# EAGLE board EEZ CF-DIC r4B4 (EAGLE 7.2.0)
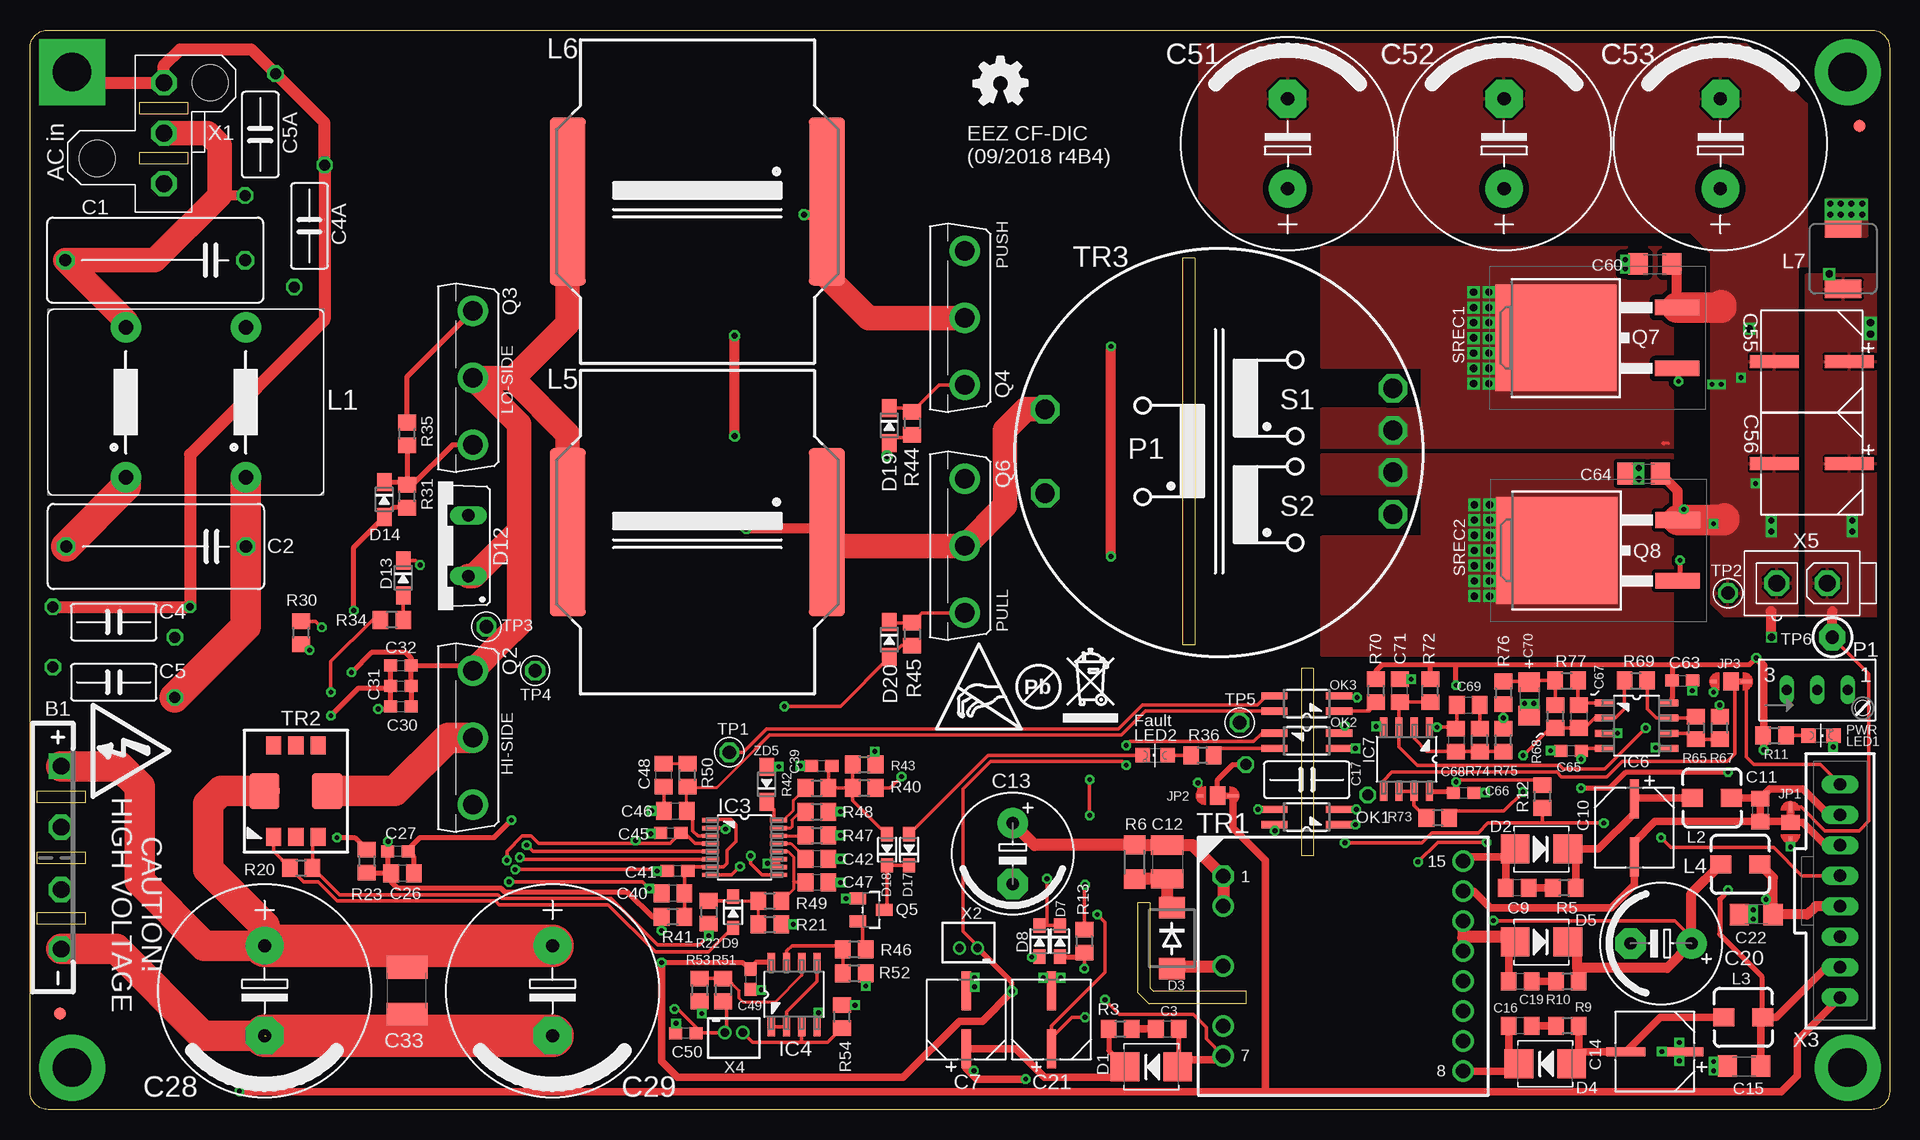
[diagram p3: board, top side]
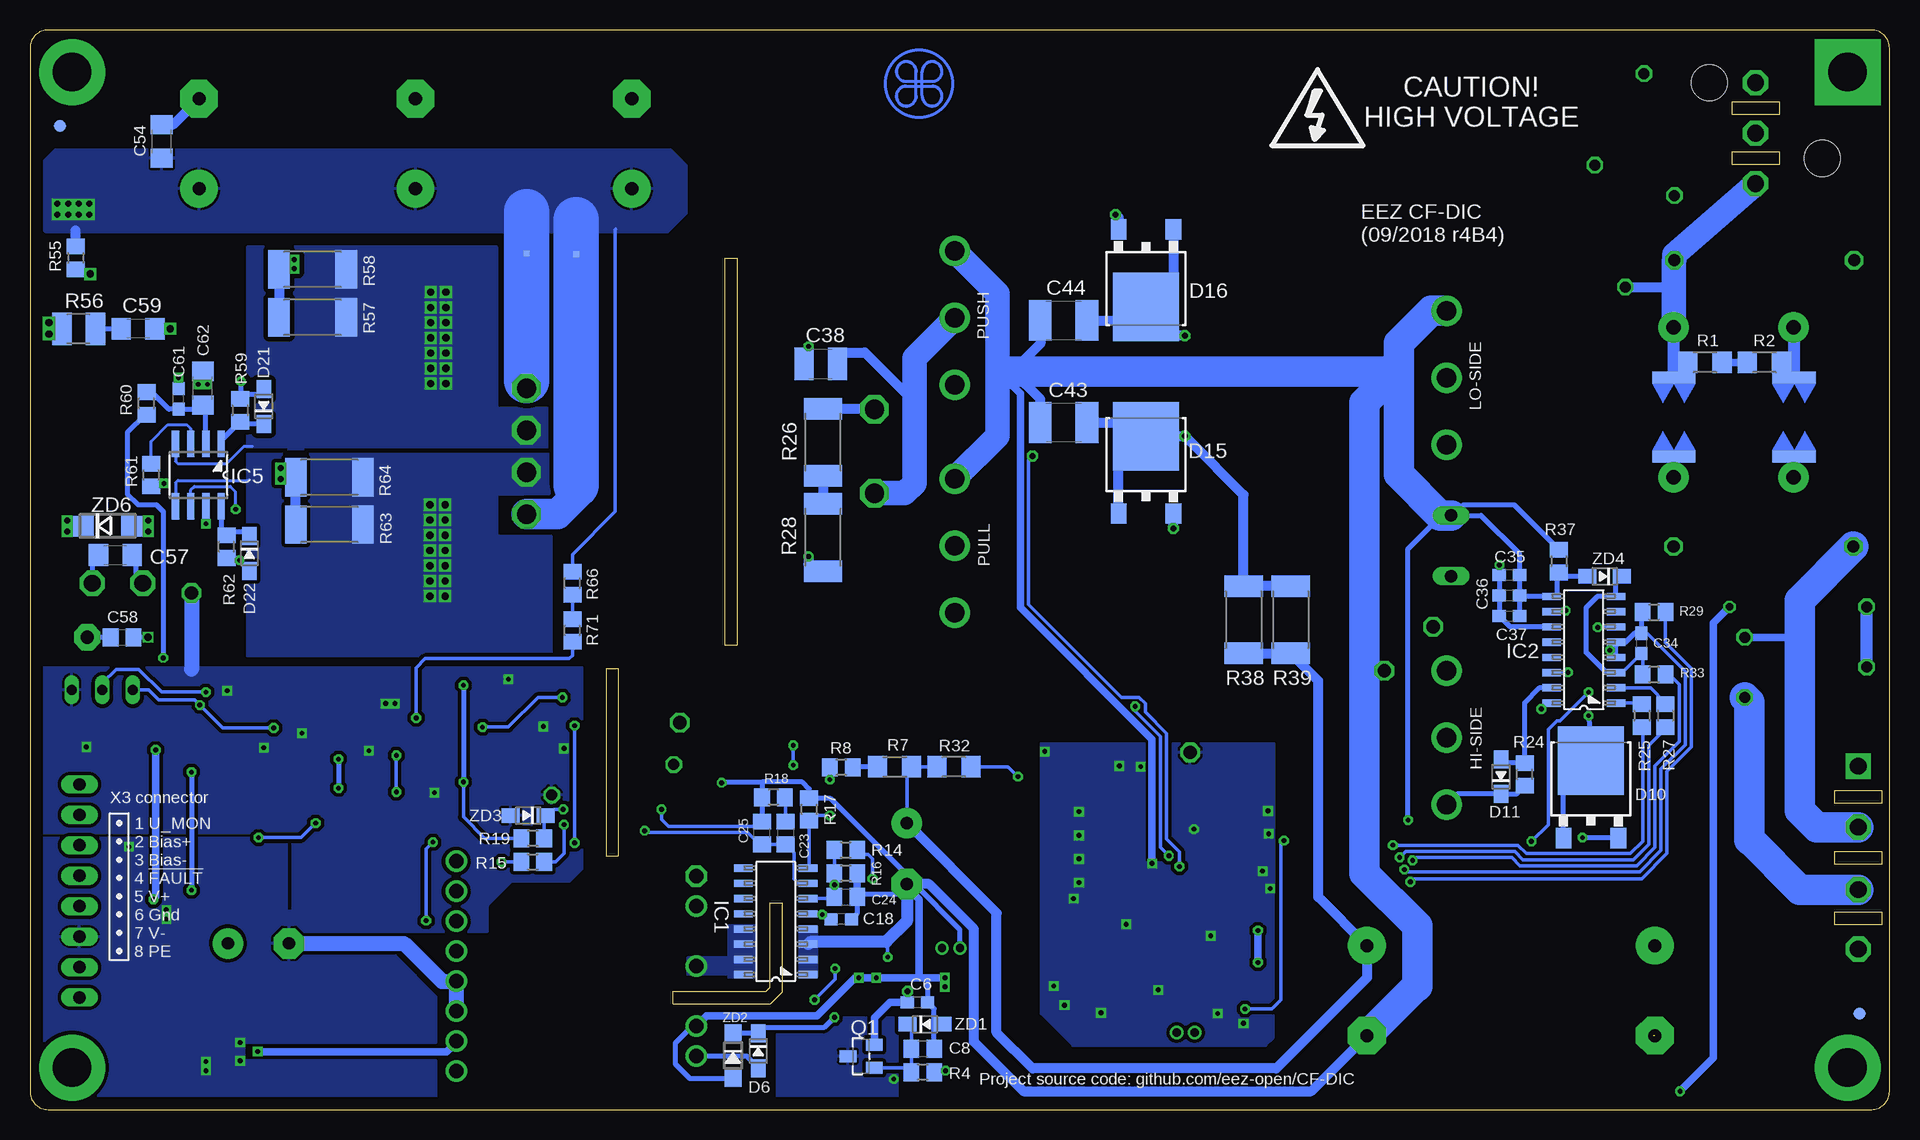
[diagram p4: board, bottom side, seen from below]

Size 155 x 90 mm. Coordinates in mm from the lower left corner, seen from the top.
Outline: 155,53.59 155,88.5 arc90 153.5,90 1.5,90 arc90 0,88.5 0,1.5 arc90 1.5,0 153.5,0 arc90 155,1.5 155,53.58
Outline: 96.08,70.99 96.08,38.73 97.09,38.73 97.09,70.99 96.08,70.99
Outline: 92.33,17.24 92.33,9.78 93.28,8.83 101.38,8.83 101.38,9.84 93.66,9.84 93.34,10.16 93.34,17.24 92.33,17.24
Outline: 105.98,36.77 105.98,21.14 107,21.14 107,36.77 105.98,36.77
Copper layers (1*16): Top 0.035mm / dielectric 1.5mm / Bottom 0.035mm
Design rules "default": minimum track width 6mil, minimum drill 0.3mm, track to track 6mil, track to pad 6mil, pad to pad 6mil, via to via 6mil, smd to smd 6mil, copper to edge 40mil, drill to drill 8mil, minimum pad ring 4mil, minimum via ring 8mil, stop-mask expansion 2.5mil, vias tented up to drill 0.55mm, thermal gap 8mil
Net classes: 0 default: width 0.203 mm, drill 0.3 mm, clearance 0.203 mm; 1 lvds: width 0.152 mm, drill 0.3 mm, clearance 0.152 mm to class 0, clearance 0.152 mm; 2 gnd: width 0.254 mm, drill 0.584 mm, clearance 0.254 mm

## Footprints (pad centres in the part's own frame; a part is rotated, then mirrored left to right if it is on the bottom)
GBU4K_CRE = drill 1.4 square: + -7.62,0 | drill 1.4 octagon: - 7.62,0; AC1 -2.54,0; AC2 2.667,0
C150-072X183 = drill 1.016 octagon: 1 -7.493,0; 2 7.493,0
C0805 = smd 1.3 x 1.5: 1 -0.95,0; 2 0.95,0
CY075-032X103 = drill 0.914 octagon: 1 -5.08,1.27; 2 5.08,-1.27
C0603 = smd 1.1 x 1: 1 -0.85,0; 2 0.85,0
CAPAE660X610N = smd 3.251 x 0.762: 1 -2.413,0; 2 2.413,0
C1210 = smd 1.6 x 2.7: 1 -1.4,0; 2 1.4,0
ECAP5/10.5 = drill 1.016 pad 2.54: + -2.54,0 | drill 1.016 pad 2.54 octagon: - 2.54,0
C1206 = smd 1.6 x 1.8: 1 -1.4,0; 2 1.4,0
ECAP7.5/18 = drill 1.1 pad 3.14: + -3.75,0 | drill 1.1 pad 3.14 octagon: - 3.75,0
C1812 = smd 1.9 x 3.4: 1 -1.95,0; 2 1.95,0
CAPAE830X1050N = smd 4.064 x 1.092: 1 -3.124,0; 2 3.124,0
EC1206 = smd 1.6 x 1.8: + -1.4,0; - 1.4,0
SMB = smd 2.4 x 2.4: A 2.2,0; C -2.2,0
DO214AA = smd 1.8 x 2.2: A 2.55,0; C -2.55,0
SOD323-W = smd 1.5 x 1.2: A 1.45,0; C -1.45,0
SOD323-R = smd 1.2 x 1: A 1.3,0; C -1.3,0
TO252 = smd 1.3 x 1.7: 1 -2.285,-5.49; 2 2.285,-5.49 | smd 5.5 x 5.7: 3 0,0.95
TO220-2 = drill 1.016 long: 1 -2.54,-2.54; 2 2.54,-2.54
FIDUCIAL_DUAL = smd 1.016 x 1.016 bottom: B 0,0 | smd 1.016 x 1.016: T 0,0
SOIC-16 = smd 1.549 x 0.61: 1 -2.692,4.445; 2 -2.692,3.175; 3 -2.692,1.905; 4 -2.692,0.635; 5 -2.692,-0.635; 6 -2.692,-1.905; 7 -2.692,-3.175; 8 -2.692,-4.445; 9 2.692,-4.445; 10 2.692,-3.175; 11 2.692,-1.905; 12 2.692,-0.635; 13 2.692,0.635; 14 2.692,1.905; 15 2.692,3.175; 16 2.692,4.445
MTC16 = smd 1.422 x 0.356: 1 -2.845,2.275; 2 -2.845,1.625; 3 -2.845,0.975; 4 -2.845,0.325; 5 -2.845,-0.325; 6 -2.845,-0.975; 7 -2.845,-1.625; 8 -2.845,-2.275; 9 2.845,-2.275; 10 2.845,-1.625; 11 2.845,-0.975; 12 2.845,-0.325; 13 2.845,0.325; 14 2.845,0.975; 15 2.845,1.625; 16 2.845,2.275
SOIC127P600X173-8N = smd 1.55 x 0.6: 1 -2.7,1.9; 2 -2.7,0.63; 3 -2.7,-0.64; 4 -2.7,-1.91; 5 2.7,-1.91; 6 2.7,-0.64; 7 2.7,0.63; 8 2.7,1.9
SO8 = smd 0.6 x 2.2: 1 -1.905,-2.6; 2 -0.635,-2.6; 3 0.635,-2.6; 4 1.905,-2.6; 5 1.905,2.6; 6 0.635,2.6; 7 -0.635,2.6; 8 -1.905,2.6
JP3-CUT = smd 1.27 x 1.524: COM 0,0 | smd 0.889 x 0.254: NC -1.27,0 | smd 0.508 x 0.254: NO 1.46,0
RN214 = drill 1.2 pad 2.54: 1 -6.25,-5; 2 6.25,-5; 3 -6.25,5; 4 6.25,5
DE0403 = smd 1.5 x 1.75: 1 0,1.626; 2 0,-1.625
MURATA_6000B = smd 3 x 14: 1 -10.8,0; 2 10.8,0
IHLP-2020BZ-11 = smd 3.048 x 1.524: 1 0,2.515; 2 0,-2.515
LED_0805 = smd 1.2 x 1.2: A 0,-1.05; C 0,1.05
SO4 = smd 0.6 x 2.2: 1 -0.635,-2.7; 2 0.635,-2.7; 3 0.635,2.7; 4 -0.635,2.7
S64W = drill 0.813 long: A 2.54,1.27; E -2.54,1.27; S 0,1.27
SOT23-BEC = smd 1 x 1.4: B -0.95,-1.1; C 0,1.1; E 0.95,-1.1
TO247BV-ROUND = drill 1.6 pad 2.54: D 0,-2.921; G -5.588,-2.921; S 5.588,-2.921
SOT23 = smd 1 x 1.4: 1 -0.95,-1.1; 2 0.95,-1.1; 3 0,1.1
TO263 = smd 1.3 x 3.7: 1 -2.54,-7.87; 2 2.54,-7.87 | smd 8.9 x 10.1: 3 0,2.23
R1206 = smd 1.6 x 1.803: 1 -1.422,0; 2 1.422,0
R0805 = smd 1.3 x 1.5: 1 -0.95,0; 2 0.95,0
R2512 = smd 1.8 x 3.2: 1 -2.8,0; 2 2.8,0
R1210 = smd 1.6 x 2.7: 1 -1.4,0; 2 1.4,0
PCB-SAR_2.4MM = smd 3.6 x 1: 1 0,-3.3; 2 0,3.3
SHORT_NOHOLE = smd 0.5 x 0.25 bottom: P$1 0,0.117; P$2 0,-0.117
PCB_SHIELD_TAB = drill 1.1 octagon: 1 0,0
TP_1.1MM_2 = drill 0.6 square: GND 5.08,0 | drill 1.1 pad 2.184 octagon: TIP 0,0
FERYSTER_5572 = drill 1.2 octagon: 1 -10,7.5 | drill 1.2: 2 -10,5; 4 -10,0; 6 -10,-5; 7 -10,-7.5; 8 10,-8.75; 9 10,-6.25; 10 10,-3.75; 11 10,-1.25; 12 10,1.25; 13 10,3.75; 14 10,6.25; 15 10,8.75
MURATA_5300 = smd 1.27 x 1.524: 1 -1.854,-3.81; 2 0,-3.81; 3 1.854,-3.81; 4 1.854,3.81; 5 0,3.81; 6 -1.854,3.81 | smd 2.54 x 3.048: 7 2.616,0; 8 -2.616,0
VAC_DUAL_SEC = drill 1.6 octagon: P1 -14.5,3.5; P1_DOT -14.5,-3.5; S1 14.5,5.25; S1_DOT 14.5,1.75; S2 14.5,-1.75; S2_DOT 14.5,-5.25
MINIFIT_39301039_CRE = drill 1.4 octagon: 1 0,4.2; 2 0,0; 3 0,-4.2 | hole 3: 5.55,2.1; -3.85,-4.2
B2B-ZR = drill 0.7 pad 1.1: 1 -0.75,0; 2 0.75,0
70543-08 = drill 1.016 long: 1 -8.89,0; 2 -6.35,0; 3 -3.81,0; 4 -1.27,0; 5 1.27,0; 6 3.81,0; 7 6.35,0; 8 8.89,0
MINIFIT_5566-02A = drill 1.4 octagon: 1 0,2.1; 2 0,-2.1
SOD123 = smd 1.4 x 1.4: A 1.9,0; C -1.9,0
DO214AC = smd 1.8 x 1.7: A 2.05,0; C -2.05,0

## Placement (x,y rotation side)
B1  GBU4K  [GBU4K_CRE]  2.6,21 270 top
C1  MKP-X2-220NR15/310  [C150-072X183]  10.44,70.8 180 top
C2  MKP-X2-220NR15/310  [C150-072X183]  10.5,46.94 180 top
C3  3n3  [C0805]  94.81,6.73 0 top
C4  CY1Y-470P  [CY075-032X103]  6.99,40.64 0 top
C4A  N.C.  [CY075-032X103]  23.29,73.66 270 top
C5  CY1Y-470P  [CY075-032X103]  6.99,35.62 0 top
C5A  N.C.  [CY075-032X103]  19.19,81.28 270 top
C6  N.C.  [C0603]  81.03,8.95 0 bottom
C7  EEEFK1V470P  [CAPAE660X610N]  78.04,7.49 90 top
C8  470n  [C0805]  80.58,5.08 0 bottom
C9  3n3  [C0805]  123.95,18.48 180 top
C10  EEEFK1V470P  [CAPAE660X610N]  133.73,23.5 270 top
C11  1u  [C0805]  144.21,24.96 270 top
C12  1n/1kV  [C1210]  94.81,20.64 270 top
C13  UCY2G6R8MPD  [ECAP5/10.5]  81.92,21.34 270 top
C14  EEEFK1V470P  [CAPAE660X610N]  135.45,4.83 180 top
C15  4u7  [C1206]  142.88,3.62 0 top
C16  3n3  [C0805]  124.21,6.99 180 top
C17  CY1Y-470P  [CY075-032X103]  106.43,27.5 0 top
C18  100n  [C0603]  87.38,15.88 180 bottom
C19  3n3  [C0805]  124.21,10.67 180 top
C20  470u  [ECAP5/10.5]  135.95,13.84 180 top
C21  EEEFK1V470P  [CAPAE660X610N]  85.15,7.49 90 top
C22  4u7  [C1206]  143.89,16.26 180 top
C23  33n  [C0805]  92.01,23.05 270 bottom
C24  100p  [C0805]  87,17.72 0 bottom
C25  2n2  [C0805]  93.98,23.05 90 bottom
C26  1u  [C0805]  31.05,19.68 180 top
C27  100n  [C0603]  30.67,21.53 180 top
C28  UCY2G121MHD  [ECAP7.5/18]  19.56,9.91 270 top
C29  UCY2G121MHD  [ECAP7.5/18]  43.56,9.91 270 top
C30  10n  [C0603]  30.92,33.59 0 top
C31  100n  [C0603]  30.92,35.31 0 top
C32  100n  [C0603]  30.92,37.02 0 top
C33  100n/500V  [C1812]  31.43,9.91 90 top
C34  100n  [C0603]  20.7,38.86 270 bottom
C35  10n  [C0603]  31.69,44.58 0 bottom
C36  100n  [C0603]  31.69,42.86 0 bottom
C37  100n  [C0603]  31.69,41.15 0 bottom
C38  2n2/1kV  [C1210]  89.09,62.17 0 bottom
C39  10n  [C0603]  65.98,28.64 180 top
C40  1u  [C0805]  53.59,18.03 180 top
C41  100n  [C0603]  53.98,19.88 180 top
C42  1u  [C0805]  65.6,20.89 180 top
C43  100n/500V  [C1812]  68.83,57.28 0 bottom
C44  100n/500V  [C1812]  68.83,65.79 0 bottom
C45  100n  [C0603]  53.4,23.05 0 top
C46  470p  [C0805]  53.78,24.89 0 top
C47  220p  [C0805]  65.6,18.92 180 top
C48  N.C.  [C0805]  52.83,27.88 90 top
C49  100n  [C0603]  60.07,10.86 270 top
C50  N.C.  [C0603]  54.67,6.35 180 top
C51  UPW1J152MHD  [ECAP7.5/18]  104.84,80.52 90 top
C52  UPW1J152MHD  [ECAP7.5/18]  122.87,80.52 90 top
C53  UPW1J152MHD  [ECAP7.5/18]  140.91,80.52 90 top
C54  1u/100V  [C1206]  144.02,80.71 90 bottom
C55  HHXC630ARA330MHA0G  [CAPAE830X1050N]  148.53,62.36 180 top
C56  HHXC630ARA330MHA0G  [CAPAE830X1050N]  148.53,53.85 180 top
C57  1u/100V  [C1206]  147.89,46.23 0 bottom
C58  100n/100V  [C0805]  147.32,39.37 0 bottom
C59  N.C.  [C1206]  145.99,65.09 180 bottom
C60  4n7/200V  [C1206]  135.45,70.48 0 top
C61  100n  [C0603]  142.62,59.25 90 bottom
C62  4u7  [C1206]  140.59,60.13 90 bottom
C63  100n  [C0603]  137.73,35.75 0 top
C64  4n7/200V  [C1206]  134.49,53.02 0 top
C65  100n  [C0603]  128.46,29.91 180 top
C66  100n  [C0603]  119.51,26.42 0 top
C67  100p  [C0805]  129.1,32.77 270 top
C68  100p  [C0805]  118.87,30.8 270 top
C69  33n  [C0805]  119.89,33.72 0 top
C70  4u7  [EC1206]  124.97,34.23 270 top
C71  1u  [C0805]  114.17,34.92 90 top
D1  SS110B  [SMB]  93.47,3.56 0 top
D2  SS110B  [SMB]  125.98,21.72 180 top
D3  US1K-DIO  [DO214AA]  95.19,14.29 270 top
D4  SS110B  [SMB]  126.3,3.81 0 top
D5  SS110B  [SMB]  125.98,13.97 180 top
D6  1N5819HW-7-F  [SOD323-W]  94.3,4.89 270 bottom
D7  BAS316  [SOD323-R]  85.85,14.03 270 top
D8  BAS316  [SOD323-R]  84.14,14.03 270 top
D9  BAS316  [SOD323-R]  58.61,16.45 270 top
D10  C3D02065E  [TO252]  24.89,28.13 0 bottom
D11  N.C.  [SOD323-W]  32.38,27.75 90 bottom
D12  C3D03060A  [TO220-2]  34,47 90 top
D13  1N5819HW-7-F  [SOD323-W]  31.11,44.32 270 top
D14  N.C.  [SOD323-W]  29.53,50.86 270 top
D15  C3D02065E  [TO252]  61.98,55.18 0 bottom
D16  C3D02065E  [TO252]  61.98,67.88 180 bottom
D17  BAS316  [SOD323-R]  73.28,21.65 90 top
D18  BAS316  [SOD323-R]  71.44,21.65 90 top
D19  1N5819HW-7-F  [SOD323-W]  71.63,57.02 270 top
D20  1N5819HW-7-F  [SOD323-W]  71.63,39.18 270 top
D21  1N5819HW-7-F  [SOD323-W]  135.51,58.61 90 bottom
D22  1N5819HW-7-F  [SOD323-W]  136.72,46.35 270 bottom
EEZ_SIGNATURE  SIGNATURESMALL  [SIGNATURE_5MM]  80.88,85.51 180 top
FM1  FIDUCIAL_2  [FIDUCIAL_DUAL]  152.5,82 0 top
FM2  FIDUCIAL_2  [FIDUCIAL_DUAL]  2.5,8 0 top
IC1  VIPer35L  [SOIC-16]  92.84,15.68 180 bottom
IC2  SI8233BB-D-IS1  [SOIC-16]  25.49,38.33 180 bottom
IC3  LM5041B  [MTC16]  59.56,21.84 0 top
IC4  LM258D  [SOIC127P600X173-8N]  63.69,9.59 90 top
IC5  IR11688STRPBF  [SO8]  140.97,52.9 180 bottom
IC6  TL072  [SOIC127P600X173-8N]  133.92,32 0 top
IC7  TL103W  [SOIC127P600X173-8N]  114.74,29.21 270 top
JP1  JP3-CUT  [JP3-CUT]  146.75,23.94 270 top
JP2  JP3-CUT  [JP3-CUT]  99,26.16 180 top
JP3  JP3-CUT  [JP3-CUT]  141.8,35.69 180 top
L1  RN214-2.5-02-3M3  [RN214]  12.99,58.96 90 top
L2  DLG-0403-180  [DE0403]  140.21,25.97 90 top
L3  DLG-0403-180  [DE0403]  142.81,7.68 90 top
L4  DLG-0403-180  [DE0403]  142.56,20.45 90 top
L5  60B684C  [MURATA_6000B]  55.63,48.13 180 top
L6  60B684C  [MURATA_6000B]  55.63,75.69 180 top
L7  IHLP2020CZER3R3M11  [IHLP-2020BZ-11]  151.13,70.93 0 top
LED1  LTST-C170YKT  [LED_0805]  149.29,31.18 270 top
LED2  LTST-C170KRKT  [LED_0805]  93.79,29.53 90 top
OK1  TLP291-GB.SE-T  [SO4]  106.43,24.38 90 top
OK2  TLP291-GB.SE-T  [SO4]  106.43,30.73 270 top
OK3  TLP291-GB.SE-T  [SO4]  106.43,33.85 90 top
P1  T910W-50K  [S64W]  148.97,33.72 0 top
Q1  MMBT5551  [SOT23-BEC]  85.72,4.45 90 bottom
Q2  C3M0280090D  [TO247BV-ROUND]  34,31 90 top
Q3  C3M0280090D  [TO247BV-ROUND]  34,61 90 top
Q4  C3M0280090D  [TO247BV-ROUND]  75,66 90 top
Q5  NYC0102BLT1G  [SOT23]  70.1,16.64 270 top
Q6  C3M0280090D  [TO247BV-ROUND]  75,47 90 top
Q7  IRFS4321PBF  [TO263]  129.41,64.33 90 top
Q8  IRFS4321PBF  [TO263]  129.48,46.61 90 top
R1  220K  [R1206]  15.38,62.29 0 bottom
R2  220K  [R1206]  10.43,62.29 0 bottom
R3  120R  [R0805]  90.87,6.73 0 top
R4  1K8  [R0805]  80.58,3.11 180 bottom
R5  120R  [R0805]  127.89,18.48 180 top
R6  220K  [R1206]  92.08,20.64 270 top
R7  220K  [R1206]  82.93,28.57 180 bottom
R8  100K  [R0805]  87.38,28.51 180 bottom
R9  120R  [R0805]  128.14,6.99 180 top
R10  120R  [R0805]  128.14,10.67 180 top
R11  470R  [R0805]  145.41,31.18 0 top
R12  10K  [R0805]  126.05,26.1 270 top
R13  N.C.  [R0805]  87.88,14.03 270 top
R14  47K  [R0805]  87,21.65 0 bottom
R15  750R  [R0805]  113.09,20.64 0 bottom
R16  12K  [R0805]  87,19.68 180 bottom
R17  1K8  [R0805]  90.04,25.02 90 bottom
R18  47K  [R0805]  93.03,26.04 180 bottom
R19  1K  [R0805]  113.09,22.61 180 bottom
R20  10K  [R0805]  22.61,20.15 0 top
R21  6R2  [R0805]  61.66,15.43 0 top
R22  N.C.  [R0805]  56.58,16.45 270 top
R23  10R  [R0805]  28.07,20.7 270 top
R24  10R  [R0805]  30.42,27.94 90 bottom
R25  100R  [R0805]  20.64,32.83 270 bottom
R26  22R/2-3W  [R2512]  88.9,55.63 90 bottom
R27  100R  [R0805]  18.67,32.83 270 bottom
R28  22R/2-3W  [R2512]  88.9,47.69 90 bottom
R29  1R  [R0805]  19.62,41.47 0 bottom
R30  30K  [R0805]  22.61,39.75 90 top
R31  10R  [R0805]  31.43,51.12 90 top
R32  220K  [R1206]  77.98,28.57 0 bottom
R33  10R  [R0805]  19.62,36.26 180 bottom
R34  10R  [R0805]  30.16,40.83 180 top
R35  47K  [R0805]  31.43,56.32 90 top
R36  1K  [R0805]  97.73,29.53 180 top
R37  1R  [R0805]  27.56,45.72 270 bottom
R38  22R/2-3W  [R2512]  53.85,40.83 270 bottom
R39  22R/2-3W  [R2512]  49.91,40.83 270 bottom
R40  100K  [R0805]  69.53,26.8 180 top
R41  10R  [R0805]  53.59,16.07 180 top
R42  1K  [R0805]  65.6,26.8 0 top
R43  6K8  [R0805]  69.53,28.77 0 top
R44  22R  [R0805]  73.53,57.21 270 top
R45  22R  [R0805]  73.53,39.62 270 top
R46  1K  [R0805]  68.71,13.34 180 top
R47  30K  [R0805]  65.6,22.86 0 top
R48  82K  [R0805]  65.6,24.83 0 top
R49  1K  [R0805]  61.66,17.4 0 top
R50  N.C.  [R0805]  54.8,27.88 90 top
R51  4K7  [R0805]  57.78,9.97 270 top
R52  1K  [R0805]  68.71,11.37 0 top
R53  30K  [R0805]  55.82,9.97 270 top
R54  10K  [R0805]  67.69,7.75 90 top
R55  100R  [R0805]  151.19,70.99 270 bottom
R56  N.C.  [R1210]  150.94,65.09 180 bottom
R57  22R/2-3W  [R2512]  131.44,66.04 180 bottom
R58  22R/2-3W  [R2512]  131.44,70.04 180 bottom
R59  3R3  [R0805]  137.48,58.29 270 bottom
R60  10R  [R0805]  145.29,58.86 90 bottom
R61  47K  [R0805]  144.91,52.9 270 bottom
R62  3R3  [R0805]  138.62,46.93 90 bottom
R63  22R/2-3W  [R2512]  130.05,48.77 180 bottom
R64  22R/2-3W  [R2512]  130.05,52.7 180 bottom
R65  10K  [R0805]  138.87,31.81 270 top
R66  316K  [R0805]  109.79,43.88 90 bottom
R67  10K  [R0805]  140.84,31.81 90 top
R68  750R  [R0805]  127.13,32.77 270 top
R69  750R  [R0805]  133.86,35.75 0 top
R70  470R  [R0805]  112.2,34.92 90 top
R71  12K  [R0805]  109.79,39.94 90 bottom
R72  3K3  [R0805]  116.71,34.92 90 top
R73  750R  [R0805]  117.35,24.32 180 top
R74  30K  [R0805]  120.84,30.8 90 top
R75  10K  [R0805]  122.81,30.8 90 top
R76  16K  [R0805]  122.81,34.73 270 top
R77  220R  [R0805]  128.08,35.75 0 top
SAR1  PCB 2.4mm  [PCB-SAR_2.4MM]  17.98,57.72 180 bottom
SAR2  PCB 2.4mm  [PCB-SAR_2.4MM]  7.95,57.72 180 bottom
SH1  [SHORT_NOHOLE]  19.56,6.16 270 bottom
SH2  [SHORT_NOHOLE]  113.6,71.37 180 top
SH3  [SHORT_NOHOLE]  109.47,71.31 0 top
TP1  [PCB_SHIELD_TAB]  58.29,29.78 180 top
TP2  [PCB_SHIELD_TAB]  141.54,43.05 180 top
TP3  [PCB_SHIELD_TAB]  38.03,40.25 90 top
TP4  [PCB_SHIELD_TAB]  42.1,36.58 0 top
TP5  [PCB_SHIELD_TAB]  100.84,32.26 90 top
TP6  [TP_1.1MM_2]  150.24,39.37 180 top
TR1  Feryster 5572  [FERYSTER_5572]  109.47,11.95 0 top
TR2  53100C  [MURATA_5300]  22.16,26.54 0 top
TR3  VAC T60006-L2025-W380  [VAC_DUAL_SEC]  99.11,54.88 0 top
U$2  [RECYCLE_BIN1/8]  86.11,32.26 0 top
U$4  [ESD_SYMBOL]  75.53,31.73 0 top
U$5  [PB_SMALL]  84.07,35.24 180 top
X1  39-30-1039  [MINIFIT_39301039_CRE]  11.16,81.39 180 top
X2  B2B-ZR  [B2B-ZR]  78.23,13.46 180 top
X3  90136-1208  [70543-08]  150.88,18.22 270 top
X4  B2B-ZR  [B2B-ZR]  58.67,6.41 0 top
X5  39-28-1023  [MINIFIT_5566-02A]  147.7,43.88 270 top
ZD1  BZX384-C13  [SOD323-W]  80.39,7.11 0 bottom
ZD2  BZT52C20-DC  [SOD123]  96.39,4.51 270 bottom
ZD3  MMSZ5V1T1G  [SOD323-W]  113.47,24.51 180 bottom
ZD4  MMSZ5V1T1G  [SOD323-W]  23.75,44.45 180 bottom
ZD5  PDZ6.2B  [SOD323-W]  61.4,27.11 90 top
ZD6  SMAJ58A-TR  [DO214AC]  148.53,48.64 0 bottom

## Tracks (layer width: path | path; a pad name or v marks a point on that pad's centre or on a via)
0V  (via drill 0.4)  (1 unrouted)
  Top 0.254: R47.2 v67.56,22.86 | v51.82,24.89 C46.1 | C47.1 v67.56,18.92 | v68.01,17.59 Q5.1 | 62.36,20.51 62.41,20.51 IC3.10
  Top 0.305: TR2.3 23.56,22.27 R20.2 25.8,17.91 39.01,17.91 39.33,17.59 48.45,17.59 52.32,13.72 55.82,13.72 v56.58,14.48 R22.2 | R30.1 22.54,38.8 | v67.56,24.83 R48.2 | v67.56,20.89 C42.1 | v51.75,22.99 52.49,22.99 C45.1 | C46.1 C48.1 | C41.2 v52.26,19.88 52.13,20 v40.45,20 | v70.42,29.84 R43.2 | C39.2 v64.2,28.64 | 68.96,17.63 Q5.1 | C50.2 v53.85,7.18 | v60.96,9.97 59.98,9.97 C49.2 | IC4.4 65.6,7.94 v65.72,8.06 | R54.2 v68.77,8.7 | v69.66,10.29 R52.2 | v56.01,8 56.01,8.7 R53.2 | v39.94,18.99 51.05,18.99 v51.63,18.41 52.26,18.41 C40.2 | OK3.3 103.06,34.48 102.3,33.72 92.71,33.72 90.74,31.75 61.4,31.75 59.44,29.78 TP1.1 | D8.A 83.54,12.73 v83.5,12.7 | OK1.3 v102.36,25.02 | v78.74,10.22 78.23,10.22 78.04,10.41 | 78.04,10.99 v78.74,10.99 | 57.91,23.43 v57.98,23.37 57.88,23.47 IC3.2 | ZD5.A 61.41,28.57 v62.42,28.57 | IC3.10 IC3.11
  Top 0.406: R35.2 31.43,61.1 Q3.S | C26.1 32,21.05 C27.1 31.52,21.68 32.51,22.67 38.67,22.67 v40.13,24.13 | v23.3,38.29 22.41,39.12 R30.1 | v63.63,15.43 R21.2 | 78.04,10.99 78.04,10.41 C7.2 | v61.47,20.51 62.36,20.51 | JP2.NO 97.54,27.05 v97.35,27.24
  Top 0.61: v85.92,10.99 85.15,10.99 | 85.15,10.99 C21.2 | 85.15,10.99 v84.45,10.99
  Top 1.016: C33.1 31.43,6.16
  Top 3.556: C28.- 31.43,6.16 C29.-
  Bottom 0.254: 22.79,38.92 22.8,38.92
  Bottom 0.305: 22.79,38.92 IC2.5 | C34.1 20.22,39.71 17.02,36.51 17.02,30.42 19.05,28.38 19.05,21.59 20.83,19.81 40.26,19.81 v40.45,20 | R29.2 18.67,38.93 16.51,36.77 16.51,30.23 18.54,28.19 18.54,21.34 20.64,19.24 39.69,19.24 v39.94,18.99 | v83.5,12.7 83.5,13.84 83.63,13.97 | v102.36,25.02 102.36,24.19 101.79,23.62 94.36,23.62 C25.2 | R18.2
  Bottom 0.406: 40.83,59.5 40.89,59.56 | C36.2 C37.2 | 27.56,46.74 R37.1 31.31,50.42 35.5,50.42 36.38,49.54 D12.2 34.05,49.54 30.86,46.35 30.86,44.6 C35.2 C36.2 | C36.2 30.75,42.77 IC2.9 27.71,42.77 27.69,42.8 27.69,44.64 R37.2 27.24,44.45 ZD4.A | v40.13,24.13 40.13,46.74 37.34,49.53 | IC2.5 22,38.96 21.25,39.71 C34.1 20.7,41.34 R29.1 | IC2.4 IC2.5 | IC2.5 22.8,38.67 v23.3,38.29 | 80.18,10.96 C6.2 79.63,8.41 79.63,7.18 | C8.2 79.63,7.18 | ZD1.A 79.57,7.11 79.63,7.18 | X2.2 77.48,15 81.28,18.8 C13.- | R16.1 86.05,19.5 86.04,17.97 82.61,17.97 C13.- | C13.- 81.92,19.56 88.33,25.97 R17.2 90.04,26.73 90.61,27.3 93.98,27.3 | C25.2 R18.2 93.98,27.3 | 93.98,27.3 97.28,27.3 v97.35,27.24 | TP4.1 43.5,36.58 43.75,36.32 | C24.2 86.05,16.36 C18.1 | ZD2.A 100.01,2.6 101.22,3.81 101.22,5.52 99.79,6.95 TR1.6
  Bottom 0.61: 74.17,61.53 73.6,61.47 73.6,60.83 72.45,59.69 72.45,41.85 61.47,30.86 v61.47,20.51 | 73.79,61.53 73.79,62.1 | 80.9,10.99 v84.45,10.99 v85.92,10.99 86.23,10.99 89.41,7.81 98.61,7.81 TR1.6 | 80.9,10.99 80.2,10.99 | 80.2,10.99 v78.74,10.99 | 80.18,10.96 80.2,10.99 | R16.1 C24.2 | 80.9,10.99 80.9,17.53 81.92,18.54 C13.-
  Bottom 0.813: C43.1 70.78,59.23 73.09,61.53 70.78,63.84 C44.1 | 73.6,61.47 73.72,61.47 73.79,61.53 | C29.- 48.19,1.52 72.2,1.52 76.33,5.65 76.33,15.05 80.07,18.8 C13.-
  Bottom 1.016: C13.- 81.92,15.68 83.63,13.97 89.95,13.97 IC1.3
  Bottom 2.032: 74.36,61.53 74.36,56.15 Q6.S | 74.36,61.53 74.36,68.03 Q4.S | 74.36,61.53 74.17,61.53 73.79,61.53 73.41,61.53
  Bottom 2.54: 73.41,61.53 73.09,61.53 40.89,61.53 | 40.89,61.53 40.89,59.56 40.89,52.96 37.47,49.53 37.34,49.53 D12.2 | 40.89,61.53 40.89,61.78 | 40.89,61.78 40.89,63.88 38.19,66.59 Q3.S | 40.89,61.78 43.75,58.93 43.75,36.32 43.75,19.68 39.37,15.3 39.37,10.29 39.43,10.29 C29.-
  pour Bottom (no thermals): 89.41,11.05 89.41,15.24 90.87,15.24 90.87,11.05
  pour Bottom (isolate 0.305): 51.31,30.48 59.75,30.48 59.75,20.57 62.1,20.57 62.1,30.48 70.74,30.48 70.74,8 68.07,5.33 52.01,5.33 51.37,5.97 51.37,6.1
6VAC
  Top 0.61: C19.2 123.26,13.44 | 123.26,13.44 D5.A | 123.26,13.44 123.26,14.41 123.25,14.41 | 119.54,14.41 119.47,14.35
  Top 1.016: TR1.13 119.47,14.35 TR1.12 | 123.25,14.41 119.54,14.41
7VAC
  Top 0.61: TR1.8 123.49,3.2 D4.C 123.26,4.66 C16.2
15VAC
  Top 0.61: D2.A 123.78,21.25 123.95,21.08 122.94,21.08 | 122.94,21.08 119.86,21.08 TR1.15 | C9.2 123,21.02 122.94,21.08
!FAULT  (via drill 0.4)
  Top 0.305: OK2.4 109.54,31.37 109.6,31.43 v109.6,32 | v109.6,22.23 116.01,22.23 116.84,23.05 120.71,23.05 121.54,23.88 125.98,23.88 | X3.4 147.7,19.49 145.35,21.84 136.78,21.84 v135.95,22.67 | v131.19,23.88 125.98,23.88 | R12.2 126.05,23.94 125.98,23.88
  Bottom 0.305: v109.6,32 v109.6,22.23 | v135.95,22.67 132.4,22.67 v131.19,23.88
+2.5VREF  (via drill 0.4)
  Top 0.305: R72.1 C71.1 114.11,33.72 IC7.3 114.11,30.23 115.63,28.7 127.51,28.7 127.83,28.38 131.25,28.38 v134.68,31.81 | R67.2 v140.84,33.72
  Bottom 0.305: v134.68,31.81 138.94,31.81 v140.84,33.72 141.29,34.16 144.27,34.16 145.1,34.99 P1.E
+5VREF  (via drill 0.4)
  Top 0.305: v39.75,20.77 39.75,21.53 41.02,22.8 41.78,22.8 42.41,22.17 50.24,22.17 v50.48,22.42 50.73,22.17 53.37,22.17 C45.2 54.55,23.05 55.44,22.17 IC3.4 | 55.71,6.16 C50.1 | R51.2 58.05,8.75 58.05,6.54 X4.1 55.59,6.41 C50.1 | C50.1 55.52,6.83 53.98,8.38 v53.72,8.38
  Bottom 0.305: R33.1 18.35,36.26 17.53,35.43 17.53,30.67 19.56,28.64 19.56,21.84 21.08,20.32 30.8,20.32 31.5,21.02 39.43,21.02 39.69,20.77 v39.75,20.77 | v50.48,22.42 50.73,22.17 50.73,9.15 51.5,8.38 v53.72,8.38
+6V_REC  (via drill 0.4)
  Top 0.305: v121.41,22.29 117.35,22.29 v115.7,20.64 | v121.98,15.75 137.1,15.75 138.49,14.35
  Top 0.813: C20.+ 138.49,14.16 | 128.97,11.81 136.46,11.81 C20.+ | 128.97,11.81 128.97,13.19 D5.C | 128.97,11.81 128.97,10.79 R10.1 | C20.+ 138.49,14.35 138.49,18.01 L4.1
  Bottom 0.305: v115.7,20.64 R15.1 | v121.98,15.75 121.98,21.72 v121.41,22.29
+12V  (via drill 0.4, 0.5)
  Top 0.305: R34.2 28.57,40.83 25.08,37.34 v25.08,34.8 | OK2.1 102.68,31.37 101.98,30.67 91.69,30.67 v91.38,30.35 | X2.1 78.98,13.65 77.79,14.85 77.79,26.73 80.07,29.02 91.06,29.02 v91.38,28.7
  Top 0.406: v29.84,22.35 29.84,21.55 C27.2 29.82,19.97 C26.2 | C26.2 28.13,19.68 R23.2 | C26.2 30.1,18.98 30.61,18.48 39.24,18.48 39.56,18.16 49.78,18.16 51.88,16.07 R41.2 52.64,14.99 v52.64,14.92 | v52.64,12.26 59.4,12.26 C49.1 60.52,12.29 IC4.8 | v81.85,9.84 81.85,10.59 X2.1
  Top 0.61: v52.64,12.26 52.64,4 53.98,2.67 72.77,2.67 77.47,7.37 79.38,7.37 v81.85,9.84
  Bottom 0.305: v29.84,22.35 28.45,23.75 28.45,31.69 27.75,32.38 27.5,32.38 v25.08,34.8 | v91.38,30.35 v91.38,28.7
  Bottom 0.61: v52.64,12.26 v52.64,14.92 | v81.85,9.84 81.88,9.82 C6.1 83.31,8.95 84.62,7.64 Q1.E
+15V_REC
  Top 0.61: R5.1 128.84,21.06 D2.C 130.75,21.72 133.73,24.7 C10.1 133.67,26.54 133.67,26.04 133.73,25.97 L2.1
-7V_REC
  Top 0.61: R9.1 129.09,4.51 | 129.09,4.51 129.09,4.4 D4.A | 129.09,4.51 129.41,4.83 C14.2 135.89,7.68 L3.1
-15V
  Top 0.61: 144.21,25.53 C11.2 | C11.2 145.74,24 146.69,24 JP1.COM 147.76,23.94 149.67,22.04 X3.3 | C11.2 142.68,24 135.45,24 133.73,22.29 C10.2 133.73,18.73 131.83,16.83 121.73,16.83 120.36,18.2 TR1.14
AC_L_IN
  Bottom 0.813: C4A.2 18.05,68.58 17.99,68.64
  Bottom 1.016: SAR1.1 17.98,62.36 | 17.98,62.36 L1.2 | R1.1 17.92,62.29 17.98,62.36
  Bottom 2.032: X1.1 17.93,71.25 C1.1 17.99,70.74 17.99,68.64 L1.2
AC_N_IN
  Top 0.813: C5A.2 15.81,76.2
  Top 2.032: X1.2 14.81,81.39 15.81,80.39 15.81,76.2 10.41,70.8 C1.2 7.99,65.75 L1.4
  Bottom 1.016: SAR2.1 7.95,62.17 | 7.95,62.17 7.95,65.17 L1.4 | R2.2 8.07,62.29 7.95,62.17
AUX_AC  (via drill 0.4)
  Top 0.305: R13.2 v87.88,11.75 | TR1.7 98.04,5.88 98.04,6.86 96.97,7.94 90.81,7.94 v89.6,9.14
  Top 0.406: D7.A 87.53,12.73 R13.2 | D1.A 95.75,4.15 C3.2
  Top 0.61: 95.75,4.15 99.17,4.15 TR1.7
  Bottom 0.305: v87.88,11.75 87.88,10.86 v89.6,9.14
  Bottom 0.406: D6.A 94.3,3.49 95.25,4.45 TR1.7
AUX_REC  (via drill 0.4)
  Top 0.305: C7.1 78.04,5.78 | v78.68,3.24 78.23,3.24 78.07,3.4
  Top 0.406: R3.1 89.92,4.91 D1.C
  Top 0.61: D1.C 91.33,3.64 90.36,2.67 84.58,2.67 82.17,5.08 C7.1 | 78.11,4.89 C7.1 | v83,2.54 78.93,2.54 78.07,3.4 78.04,3.43 C7.1
  Bottom 0.305: v78.68,3.24 79.5,3.24 R4.1
  pour Bottom (isolate 0.305): 82.68,7.62 92.71,7.62 92.71,0.06 82.68,0.06
BUCK_OUT  (via drill 0.4)
  Top 0.305: 37.08,36.75 Q2.S | TP3.1 38.18,40.25 39.37,39.05
  Top 0.406: C32.2 C31.2 C30.2 | C32.2 31.77,37.63 31.3,38.1 28.45,38.1 v26.8,36.45 | C32.2 36.49,37.02 Q2.S
  Top 2.032: Q2.S 36.92,36.6 39.37,39.05 40.77,40.45 40.77,48.26 | 40.77,48.26 40.77,57.15 Q3.D 40.16,61 40.23,60.93 | D12.1 36.97,44.46 40.77,48.26 | L6.2 44.83,65.53 40.23,60.93 | L5.2 44.83,56.33 40.23,60.93
  Bottom 0.406: v26.8,36.45 28.16,36.45 IC2.14
CLAMP_C  (via drill 0.5)
  Top 0.813: v58.74,56.13 v58.74,64.52
  Bottom 0.813: D16.1 59.69,69.22 D16.3 | C44.2 63.12,65.79 D16.3 | C43.2 63.12,57.28 D15.3 | D15.1 64.26,53.85 D15.3 | v58.74,64.52 59.63,64.52 59.69,64.58 59.69,64.64 D16.3 | R39.1 R38.1 53.85,51.24 58.36,55.75 v58.73,56.13 | v58.73,56.13 v58.74,56.13 | D15.3 v58.73,56.13
CT_OUT
  Top 0.254: 58.67,17.4 R49.1 R21.1
  Top 0.305: 58.61,17.78 D9.C 58.61,17.46 58.67,17.4 R22.1
DC_BUS
  Top 1.016: C33.2 31.43,13.66 | TR1.2 TR1.1 96.9,22.02 96.9,22.04 C12.1 92.1,22.04 R6.1 83.73,22.06 C13.+
  Top 2.54: B1.+ 7.45,28.62 9.14,26.92 9.14,19.05 14.54,13.66 C28.+ 19.56,15.3 14.86,20 14.86,25.46 15.94,26.54 TR2.8
  Top 3.556: C28.+ 31.43,13.66 C29.+
  Bottom 0.305: C29.+ | R32.1 R7.1 81.92,28.17 C13.+
  Bottom 0.813: C13.+ 74.42,16.38 74.42,6.41 71.44,3.43 51.12,3.43 43.56,10.99 C29.+ 47.62,17.72 47.62,35.74 R39.2 R38.2
DC_OUT
  Top 0.61: L2.2 144.14,25.97 C11.1 145.04,26.73 147.76,26.73 149.92,24.57 X3.2
FB  (via drill 0.4)
  Top 0.305: R76.2 v122.81,32.64 R75.2
  Bottom 0.305: R71.1 109.79,37.85 110.05,37.59 122.05,37.59 122.81,36.83 v122.81,32.64
FB2  (via drill 0.4)
  Top 0.305: OK1.2 v110.55,25.02
  Bottom 0.305: R19.1 112.14,24.2 ZD3.C 111.33,25.02 v110.55,25.02
GND  (via drill 0.4, 0.5, 0.6)
  Top 0.254: 137.86,49.47 v137.86,50.04 137.35,50.04
  Top 0.305: C70.- v124.59,33.85 | 131.23,31.5 IC6.3 v132.33,31.36 v132.33,31.37 | IC7.4 112.23,31.91 v112.2,31.94 | v146.75,21.91 JP1.NO | C71.2 v115.13,35.88 | C65.2 v126.75,29.91 | OK2.3 v110.49,30.1 | 138.56,35.73 C63.2 | LED1.C 150.34,30.26 v150.3,30.23
  Top 0.406: C15.1 140.72,3.62 v140.34,3.24 | 138.56,35.73 v138.56,34.92 | v121.28,26.42 120.33,26.44 C66.2 | v143.64,16.64 142.87,16.64 C22.2 | v135.51,30.16 136.56,30.16 IC6.5 | v137.48,4.06 137.48,4.45 C14.1
  Top 0.61: C14.1 v136.02,4.83
  Top 0.813: Q8.2 137.35,50.04 137.35,51.57 C64.2 | Q7.2 137.28,70.05 C60.2 | TP6.GND 145.16,41.47 145.1,41.53 145.16,41.53
  Top 2.54: Q7.2 140.97,66.86 140.97,67.06 | Q8.2 141.22,49.15 141.22,49.28
  Bottom 0.254: IC5.7 v140.34,48.83 | IC5.6 141.6,51.63 141.29,51.94 138.3,51.94 137.86,51.5 v137.86,50.04
  Bottom 0.406: C59.1 v143.32,65.09 | TP6.GND C58.2 | v140.21,60.45 140.53,61.47 C62.2 | v142.62,61.02 C61.2 | C57.2 146.18,46.23 146.18,44.45 X5.2 | ZD6.A 145.61,48.64 v145.16,49.09 | v143.83,52.2 R61.2
  Bottom 0.61: TR1.9 119.47,5.62 120.27,4.83 v136.02,4.83
  Bottom 0.813: C54.2 143.07,82.11 C53.-
  Bottom 1.27: TR1.10 TR1.11 119.51,10.67 120.65,10.67 123.83,13.84 C20.- | TP2.1 141.54,36.7
  other vias: 140.97,60.45 145.16,48.2 125.35,33.85 143.64,15.88 140.34,4 137.48,5.59
  pour Top (isolate 0.508, rank 2): 98.3,89.92 141.99,89.92 148.08,83.82 148.08,41.15 141.22,41.15 140.21,42.16 140.21,71.37 138.43,73.15 100.33,73.15 97.54,75.95 97.54,89.15
  pour Bottom (isolate 0.305): 155.19,0.25 121.16,0.25 121.16,4.06 137.16,4.06 137.16,5.59 121.16,5.59 121.16,9.4 124.46,12.76 132.33,12.76 132.33,14.86 116.84,14.86 116.84,17.02 114.81,19.05 109.98,19.05 108.97,20.07 108.97,36.83 155.19,36.83 155.19,23.11 133.1,23.11 133.1,16.51 133.6,16.51 133.6,22.61 155.19,22.61
GNDA
  Top 2.54: B1.- 7.19,13.38 14.41,6.16 SH1.P$1
HD  (via drill 0.4)
  Top 0.305: IC3.5 41.92,21.52 v41.4,22.04
  Bottom 0.305: 20.95,31.56 R25.2 20.57,31.82 20.57,22.35 21.59,21.34 30.29,21.34 30.99,22.04 v41.4,22.04
HI_OUT
  Bottom 0.406: D11.A 32.08,28.89 R24.2 30.42,33.91 29.17,35.15 IC2.15
HOLE_DL  (via drill 3.2 pad 5.5)
  other vias: 3.5,3.5
HOLE_DR  (via drill 3.2 pad 5.5)
  other vias: 151.5,3.5
HOLE_UR  (via drill 3.2 pad 5.5)
  other vias: 151.5,86.5
ISO_FB
  Top 0.254: 61.53,31.11 60.48,30.07 57.28,26.86 54.73,26.86 C46.2
  Top 0.305: IC3.3 55.67,22.82 55.24,23.24 55.24,24.38 C46.2 | 54.73,26.86 R50.1 | 60.48,30.07 61.66,31.24 91,31.24 92.96,33.21 100.78,33.21 | OK3.4 100.78,33.21 | TP5.1 100.84,33.15 100.78,33.21
L_PULL  (via drill 0.5)
  Top 0.813: v59.69,48.45 60.08,48.45 66.11,48.45 L5.1
  Top 2.032: TR3.P1 83.02,58.38 81.28,56.64 81.28,50.36 Q6.D 66.67,47 66.48,47.18 66.48,48.08 L5.1
  Bottom 0.813: R26.2 84.66,58.43 TR3.P1 | v59.69,48.45 D15.2
L_PUSH  (via drill 0.5)
  Top 0.813: v64.52,74.61 66.36,74.61
  Top 2.032: Q4.D 69.89,66 66.36,69.53 66.36,74.61 66.36,75.62 L6.1
  Bottom 0.813: 81.41,61.09 81.28,60.96 | 81.34,62.04 81.28,62.1 | 81.28,58.99 85.41,63.12 87.76,63.12 87.69,63.05 C38.2 | D16.2 64.26,73.41 64.26,74.36 v64.52,74.61
  Bottom 2.032: TR3.P1_DOT 82.1,51.38 81.28,52.2 81.28,58.99 81.28,60.96 81.28,62.1 81.28,62.64 Q4.D
LD  (via drill 0.4)
  Top 0.305: IC3.6 40.98,20.87 v40.83,21.02
  Bottom 0.305: R27.2 18.67,31.75 20.07,30.35 20.07,22.1 21.34,20.83 30.54,20.83 31.24,21.53 40.32,21.53 v40.83,21.02
LO_OUT  (via drill 0.4)
  Top 0.406: R31.1 30.28,50.17 D14.A 26.99,46.87 v26.99,41.59
  Bottom 0.406: IC2.10 27.08,41.5 v26.99,41.59
N$2  (via drill 0.4)
  Top 0.305: R40.1 71.69,26.8 v72.64,27.75
  Bottom 0.305: R32.2 73.47,28.57 v72.64,27.75
N$3  (via drill 0.4)
  Top 0.406: C31.1 C32.1 | C31.1 C30.1 29.88,33.4 v29.02,33.4 | C31.1 30.07,35.15 30.04,35.12 27.37,35.12 v25.08,32.83
  Bottom 0.406: IC2.16 28.54,33.88 v29.02,33.4 | v25.08,32.83 D10.3 27.18,26.8 D10.1
N$4
  Top 0.406: JP2.COM 99,27.5 100.27,28.77 C17.1
N$5
  Bottom 0.813: R26.1 R28.2
N$6
  Bottom 0.406: IC5.2 140.34,58.48 C62.1 140.93,58.4 C61.1 143.42,58.4 144.84,59.81 R60.2
N$7
  Top 0.305: R54.1 66.48,5.59 64.33,5.59 | 64.33,5.59 60.25,5.59 X4.2 | IC4.3 64.33,5.59
N$8
  Bottom 0.406: R56.1 C59.2
N$9
  Top 0.305: R74.2 C69.2
N$10
  Top 0.305: R75.1 R74.1 C68.2 116.46,29.85 115.38,30.92 IC7.2
N$11
  Top 0.305: R11.2 LED1.A
N$12
  Bottom 0.305: R66.1 R71.2
N$13
  Top 0.305: Q4.G 75.78,60.41 R44.1 73.22,58.47 D19.C
N$14
  Top 0.305: Q6.G 74.37,41.41 R45.1 71.75,40.57 D20.C
N$15
  Top 2.54: C5.2 18,40.28 C2.1 L1.1
  Bottom 1.016: L1.1 17.99,54.41 SAR1.2
  Bottom 2.54: C5.2 11.68,33.97 11.68,22.54 | 11.68,22.48 11.68,22.54 | 11.68,22.54 7.47,18.33 B1.AC2
N$16
  Top 0.305: R36.2 LED2.A
N$17  (via drill 0.4)
  Top 0.813: v90.11,46.1 v90.11,63.63
  Bottom 0.406: C38.1 90.17,62.49 v90.11,63.63
  Bottom 0.813: R28.1 89.53,44.89 90.11,45.47 v90.11,46.1 | C38.1 90.49,61.98
N$18
  Bottom 0.254: R61.1 144.91,55.69 143.51,57.09 141.92,57.09 141.6,56.77 IC5.3
N$19
  Top 0.254: R48.1 64.2,24.83 63.5,24.13 63.5,23.56 63.41,23.47 IC3.15
N$20  (via drill 0.4)
  Top 0.305: v88.33,27.5 v88.33,24.51
  Bottom 0.305: R17.1 90.04,20.23 IC1.8 | R8.2 v88.33,27.5 | R17.1 | R17.1 90.04,24.45 89.98,24.51 v88.33,24.51
N$21
  Bottom 0.406: R24.1 31.11,26.3 D11.C 36.03,26.3 Q2.G
N$22
  Top 0.254: IC3.14 64.61,22.82 R47.1
N$23
  Top 0.254: 64.52,20.89 C42.2 64.64,20.95 63.43,22.17 IC3.13
N$24
  Top 2.54: L1.3 7.99,51.92 C2.2
  Bottom 0.61: C4.2 7.49,39.37
  Bottom 1.016: L1.3 7.99,54.38 SAR2.2
  Bottom 2.54: B1.AC1 6.08,23.54 7.49,24.96 7.49,39.37 7.49,42.45 C2.2
N$25
  Top 0.254: R42.1 63.63,25.78 63.63,24.96 62.79,24.12 IC3.16 62.04,24.12
  Top 0.305: 62.04,24.12 62.04,25.03 ZD5.C
N$26
  Top 0.254: IC4.6 64.33,11.18 62.1,8.95 59.44,8.95 59.12,9.27 59.12,9.91 58.1,10.92 R51.1
  Top 0.305: R53.1 R51.1
N$27  (via drill 0.4)
  Top 0.305: 85.15,5.97 85.15,6.99 89.6,11.43 89.6,15.62 v88.96,16.26 | 85.15,5.97 C21.1 85.15,3.81 85.22,3.75 | v87.95,7.68 86.87,7.68 85.15,5.97
  Bottom 0.305: C18.2 88.39,16.19 88.9,16.19 v88.96,16.26 89.03,16.32 IC1.5
  Bottom 0.406: ZD2.C 94.37,6.41 D6.C 94.3,6.86 88.77,6.86 v87.95,7.68
N$29
  Top 0.406: R31.2 31.88,52.07 35.22,55.41 Q3.G | R35.1 R31.2 | D14.C 31.19,52.31 R31.2
N$31  (via drill 0.4)
  Top 0.406: 27.88,21.65 R23.1 27.05,22.67 v25.59,22.67
  Bottom 0.406: D10.2 25.56,22.64 v25.59,22.67
N$32
  Top 0.305: OK2.2 98.87,30.1 R36.1
N$33
  Bottom 0.61: R2.1 R1.2
N$35
  Top 0.254: R50.2 C48.2
N$36
  Bottom 0.305: IC2.1 20.74,33.88 R25.1
N$37
  Top 0.254: IC3.12 63.19,21.52 63.63,21.08 63.63,18.99 | C47.2 63.69,18.92 63.63,18.99 | 63.63,18.99 63.63,18.35 62.68,17.4 R49.2
N$38
  Top 0.305: IC4.7 63.06,13.21 63.5,13.65 67.44,13.65 R46.2 R52.1
N$40
  Bottom 0.305: 18.63,33.82 R27.1 18.67,33.91 19.91,35.15 IC2.2
N$42
  Top 0.305: IC4.1 IC4.2 63.06,8.13 65.6,10.67 IC4.5
N$48  (via drill 0.4)
  Top 0.305: 22.54,41.15 R30.2 23.82,40.7 v24.32,40.2
  Bottom 0.305: IC2.6 24.28,40.23 v24.32,40.2
N$49
  Bottom 0.406: R7.2 85.98,28.57 R8.1
N$50
  Top 0.305: TR2.1 20.31,21.5 R20.1 22.1,19.71 22.1,19.68 22.8,18.99 24,18.99 25.59,17.4 38.8,17.4 39.12,17.08 48.2,17.08 52.13,13.14 56.58,13.14 58.58,15.15 D9.A 58.61,15.49
N$53
  Top 0.305: R65.1 138.75,32.63 IC6.7 135.58,32.63 134.81,33.4 R69.2
N$54
  Top 0.305: R41.1 C40.1 54.54,19.59 C41.1 55.17,20.22 IC3.7 57.81,20.22 58.1,20.51 58.1,21.59 58.86,22.35 58.86,23.75 58.42,24.19 56.79,24.19 IC3.1
N$55  (via drill 0.4)
  Top 0.305: D13.C 32.14,45.77 v32.51,45.4
  Bottom 0.406: IC2.11 31.62,40.23 C37.1 C36.1 C35.1 v32.51,45.4
N$56
  Top 2.54: TR2.7 30.42,26.54 34.87,31 Q2.D
N$57
  Top 0.305: IC7.5 112.83,27.43 113.54,28.13 127.25,28.13 127.64,27.75 131.44,27.75 132.72,29.02 141.48,29.02 142.11,29.65 142.11,34.92 JP3.COM
N$58  (via drill 0.4)
  Top 0.305: JP3.NO v140.34,34.8
  Bottom 0.305: P1.S 148.97,35.56 147.83,36.7 145.92,36.7 144.02,34.8 v140.34,34.8
N$63
  Top 0.305: R34.1 D13.A
N$64  (via drill 0.4)
  Top 0.305: C67.2 R68.2 126.75,31.82 v124.46,29.53 | C67.2 129.29,31.82 | R69.1 132.91,35.88 132.91,33.4 132.14,32.63 IC6.2 130.42,32.63 129.61,31.82 C67.2 | R73.1 118.3,24.83 118.36,24.89 122.87,24.89 v124.46,26.48
  Bottom 0.305: v124.46,26.48 v124.46,29.53
N$66  (via drill 0.4)
  Top 0.305: v132.97,70.87 133.1,70.99 133.92,70.99 C60.1 133.35,70.48 v132.97,70.1
  Bottom 0.305: 134.56,70.29 R58.2 133.03,70.04 v132.97,70.1
  Bottom 0.813: R58.2 R57.2
N$67  (via drill 0.5)
  Top 0.406: C64.1 v134.11,52.58 v134.11,53.47
  Bottom 0.406: v134.11,52.58 133.17,53.02 R64.2
  Bottom 0.813: R63.2 R64.2
N$74
  Bottom 0.406: IC5.1 139.06,55.76 R59.2 137.29,57.16 D21.C
N$75
  Bottom 0.406: IC5.8 139.06,48.32 R62.2 138.62,47.94 138.37,48.2 137.02,48.2 D22.C
N$76  (via drill 0.4)
  Top 0.305: C69.1 118.94,31.81 C68.1 118.74,31.88 v117.28,31.88 116.68,31.88 IC7.1 | OK3.2 110.49,34.48 v110.62,34.35
  Bottom 0.305: v117.28,31.88 115.13,31.88 112.65,34.35 v110.62,34.35
N$100
  Top 0.305: Q5.2 69.4,15.69 69.41,15.68 69.41,13.59 R46.1
N$126
  Top 0.305: Q5.3 71.44,16.87 D18.C D17.C
N$130
  Top 0.305: D17.A 79.85,29.53 LED2.C
N$132
  Top 0.305: R67.1 R65.2 138.37,31.36 IC6.6
N$133
  Bottom 0.305: 81.81,2.83 R4.2 | R4.2 C8.1 | C8.1 81.53,6.8 ZD1.C | 81.66,4.96 C8.1 | Q1.B 81.92,3.5 R4.2
N$134
  Top 0.305: R77.2 129.03,33.78 C67.1 | 129.41,34.03 C67.1 | IC6.1 129.28,33.9 C67.1
N$135  (via drill 0.4)
  Top 0.305: OK1.1 v110.49,23.75
  Bottom 0.305: v110.49,23.75 110.49,21.34 111.19,20.64 R15.2
N$137
  Top 1.016: D3.C 94.81,16.9 C12.2 94.78,19.21 R6.2
N$138  (via drill 0.4)
  Top 0.305: OK1.4 103.73,23.27 v103.76,23.24
  Bottom 0.305: IC1.7 90.93,18.86 91.31,19.24 91.31,21.4 C23.2 C25.1 94.43,22.1 94.43,22.36 95.19,23.11 103.63,23.11 v103.76,23.24
N$139
  Top 0.61: C9.1 R5.2
N$140
  Top 0.61: C3.1 R3.2
N$141  (via drill 0.4)
  Top 0.305: R13.1 87.88,18.67 v87.94,18.73
  Bottom 0.305: IC1.6 88.07,17.59 C24.1 87.94,18.22 v87.94,18.73 R16.2 R14.1
N$144
  Top 0.61: C16.1 R9.2
N$146
  Top 0.61: C19.1 R10.2
N$152
  Bottom 0.305: C23.1 92.01,25.97 R18.1
N$155  (via drill 0.4)
  Top 0.305: D8.C 84.64,15.33 | 84.64,15.33 D7.C | v84.77,19.24 84.77,15.46 84.64,15.33
  Bottom 0.305: 85.6,21.27 85.15,21.27 84.77,20.89 v84.77,19.24
  Bottom 0.406: R14.2 85.98,21.65 85.6,21.27
NFB_OFFSET
  Top 0.305: R68.1 R77.1 125.09,35.75 C70.+ 124.91,35.68 R76.1
OK_A
  Top 0.305: OK3.1 111.63,33.21 R70.1
PE  (via drill 0.4, 0.6, 3.2 pad 5.5)
  Top 0.61: 103,1.46 145.99,1.46 147.32,2.79 147.32,5.78 X3.8 | 103,1.46 103,20.77 100.27,23.5 JP2.NC | 103,1.46 17.53,1.46 v17.46,1.52
  Top 1.016: C4.1 v13.34,41.91 13.34,54.61 24.56,65.84 C4A.1 24.56,82.26 C5A.1 18.43,88.39 12.51,88.39 11.16,87.05 X1.3 4.41,85.59 v3.5,86.5
  Bottom 0.61: v17.46,1.52 14.67,4.32 14.67,40.58 v13.34,41.91
  Bottom 1.016: C5.1 C4.1
POUT+  (via drill 0.5)
  Bottom 0.305: R66.2 109.79,46.29 106.24,49.85 106.24,73.34 106.17,73.41
  Bottom 0.813: R55.1 151.19,73.28
  Bottom 3.81: SH2.P$2 113.6,74.87 | SH3.P$1 109.47,74.17
  other vias: 152.72,74.61 150.94,74.61 151.83,74.61 150.05,74.61 150.05,75.5 150.94,75.5 151.83,75.5 152.72,75.5
  pour Bottom (isolate 0.406, rank 2): 152.91,80.01 101.6,80.01 100.33,78.74 100.33,74.68 101.85,73.15 153.67,73.15 153.92,73.41 153.92,78.99
  pour Top (no thermals): 149.73,75.88 153.1,75.88 153.1,72.77 149.73,72.77
PREG_OUT+  (via drill 0.5, 0.6)
  Top 0.305: JP1.NC 147.64,25.21 149.61,23.24 152.46,23.24 153.29,24.07 153.29,36.32 TP6.TIP
  Top 0.406: v149.99,69.66 149.99,68.45 | 149.92,68.45 149.99,68.45 | 149.99,68.45 151.09,68.45 L7.2
  Top 0.813: TP6.TIP 150.24,41.53
  Bottom 0.406: R55.2 151.2,69.66 v149.99,69.66 | R56.2 v153.42,64.64 | ZD6.C v151.89,49.09 | C57.1 149.35,46.23 149.8,45.78 X5.1 | C58.1 TP6.TIP
  other vias: 153.42,65.6 151.89,48.2
  pour Top: 148.08,69.6 155.19,69.6 155.19,41.15 148.08,41.15
PULL  (via drill 0.4)
  Top 0.305: R45.2 72.64,38.67 D20.A | D20.A 71.69,38.23 | IC3.9 61.01,19.57 60.07,20.51 v60.07,21.14 | v62.88,33.6 67.56,33.6 D20.A
  Bottom 0.305: v62.88,33.6 62.88,33.22 60.77,31.11 60.77,21.84 v60.07,21.14
PUSH  (via drill 0.4, 0.5)
  Top 0.305: IC3.8 58.49,19.57 v59.18,20.26 | R44.2 73.28,56.01 71.63,56.01 D19.A 71.44,55.38 v71.44,54.48
  Bottom 0.305: v59.18,20.26 59.18,21.46 60.26,22.54 60.26,31.37 62.04,33.15 62.04,33.85 62.55,34.35 64.01,34.35 71.75,42.1 71.75,54.17 v71.44,54.48
REF
  Bottom 0.305: IC2.3 22.29,36.42 C34.2 20.57,37.88 R33.2
  Bottom 0.406: 20.66,37.78 C34.2 | ZD4.C 22.8,43.95 IC2.8 24.35,42.77 25.27,41.85 25.27,38.1 23.62,36.45 22.82,36.45 IC2.3
S1_DOT_OUT  (via drill 0.6)
  Top 0.254: 136.59,55.56 136.08,55.56 136.21,55.5
  Bottom 0.254: IC5.4 142.88,54.04 142.69,53.85 138.62,53.85 137.16,55.31 136.46,55.31
  other vias: 121.6,64.33 120.33,64.33 120.33,65.6 120.33,66.87 120.33,68.14 120.33,63.06 120.33,61.79 121.6,63.06 121.6,61.79 121.6,60.52 121.6,65.6 121.6,66.87 121.6,68.14 120.33,60.52
  pour Top (isolate 0.406, rank 2, no thermals): 107.7,58.42 116.08,58.42 116.08,61.85 107.7,61.85 107.7,71.88 136.91,71.88 136.91,55.12 107.7,55.12
  pour Bottom (isolate 0.406, rank 2, no thermals): 111.51,58.42 116.08,58.42 116.08,71.88 136.91,71.88 136.91,55.12 111.51,55.12
S1_OUT
  Bottom 2.54: TR3.S1 113.61,61.27 113.6,60.77
  Bottom 3.81: 113.6,60.77 SH2.P$1
S2_DOT_OUT
  Bottom 2.54: TR3.S2_DOT 111.03,49.63 109.35,51.31 109.35,51.94 109.47,52.07
  Bottom 3.81: 109.47,52.07 SH3.P$2
S2_OUT  (via drill 0.6)
  Bottom 0.254: 136.72,52.51 136.78,52.45 142.69,52.45 142.88,52.26 IC5.5
  other vias: 121.67,42.8 121.67,44.07 121.67,45.34 121.67,46.61 121.67,47.88 121.67,49.15 121.67,50.42 120.4,42.8 120.4,44.07 120.4,45.34 120.4,46.61 120.4,47.88 120.4,49.15 120.4,50.42
  pour Top (isolate 0.305, no thermals): 107.7,47.75 116.08,47.75 116.08,51.31 107.7,51.31 107.7,54.61 136.91,54.61 136.91,37.85 107.7,37.85
  pour Bottom (isolate 0.305, no thermals): 111.51,47.75 116.08,47.75 116.08,51.31 111.51,51.31 111.51,54.61 136.91,54.61 136.91,37.85 111.51,37.85
SR_OUT1  (via drill 0.4)
  Top 0.406: v137.41,60.71 137.41,61.65 Q7.1
  Bottom 0.406: R59.1 137.48,59.56 137.41,59.63 | 137.41,59.63 135.94,59.63 D21.A | 137.41,59.63 v137.41,60.71
SR_OUT2  (via drill 0.4)
  Top 0.406: 137.29,44.13 Q8.1 137.54,44.26 v137.54,45.78
  Bottom 0.406: R62.1 137.73,45.98 v137.54,45.78 137.36,45.6 D22.A
U_MON
  Top 0.305: JP3.NC 143.06,29.4 143.7,28.77 149.22,28.77 X3.1
U_MON1
  Top 0.305: IC7.6 IC7.7 115.37,25.34 R73.2
ULVO
  Top 0.305: R40.2 R42.2 66.55,28.22 C39.1 | R40.2 R43.1 | R40.2 68.58,25.78 70.87,23.5 71.07,23.3 D18.A 71.5,23.02
V+  (via drill 0.4)
  Top 0.305: v118.87,27.3 119,27.3 119.19,27.5 125.6,27.5 R12.1 | R11.1 144.97,31.18 144.53,31.11
  Top 0.406: 116.71,37.08 112.71,37.08 112.2,36.58 R70.2 | 116.71,37.08 118.87,37.08 | 118.87,37.08 136.91,37.08 | 136.91,37.08 136.91,35.77 C63.1 136.88,34.29 IC6.8 | R72.2 116.71,37.08 | v118.87,35.37 118.87,37.08 | v118.87,27.3 118.87,26.5 C66.1 118.56,26.51 IC7.8 | 136.91,37.08 143.32,37.08 v143.89,37.66
  Top 0.61: L4.2 144.21,20.45 | v144.53,29.97 144.53,31.11 144.53,37.02 v143.89,37.66 | 145.29,16.7 145.29,16.95 v144.72,17.53
  Top 0.813: L4.2 145.29,19.34 145.29,16.7 C22.1 148.15,16.26 148.84,16.95 X3.5
  Bottom 0.305: v118.87,27.3 118.87,24.38 117.09,22.61 R19.2
  Bottom 0.406: R60.1 145.41,57.91 146.88,56.45 146.88,51.31 145.99,50.42 144.46,50.42 143.89,49.85 v143.89,37.66 | v118.87,35.37 v118.87,27.3
  Bottom 0.61: v144.53,29.97 144.53,17.72 v144.72,17.53
V-  (via drill 0.4)
  Top 0.305: IC6.4 129.5,30.09 C65.1
  Top 0.406: C65.1 129.31,29.23 v129.29,29.21 | v141.54,28.13 133.03,28.13 131.7,26.8 v129.29,26.8 | L3.2 144.34,7.79 144.34,11.11 140.84,14.61 140.84,17.53 141.54,18.22 v141.54,18.29
  Top 0.61: C15.2 144.28,7.52 L3.2 145.54,7.68 149.73,11.87 X3.7
  Bottom 0.406: v129.29,29.21 v129.29,26.8 | v141.54,28.13 v141.54,18.29
VIPER_D
  Top 1.016: D3.A 95.08,11.95 TR1.4
  pour Bottom (isolate 0.305, no thermals): 93.98,10.92 93.98,15.3 96.77,15.3 96.77,12.64 100.2,12.64 100.2,11.3 96.77,11.3 96.77,10.92

## Text on the board
tPlace: AC in | EEZ CF-DIC / (09/2018 r4B4) | PUSH | SREC1 | LO-SIDE | SREC2 | PULL | Fault | PWR | HI-SIDE | CAUTION! / HIGH VOLTAGE
bPlace: CAUTION! / HIGH VOLTAGE | EEZ CF-DIC / (09/2018 r4B4) | PUSH | LO-SIDE | PULL | HI-SIDE | X3 connector | 1 U_MON | 2 Bias+ | 3 Bias- | 4 !FAULT! | 5 V+ | 6 Gnd | 7 V- | 8 PE | Project source code: github.com/eez-open/CF-DIC
Measures: Licensed under the TAPR Open Hardware License (www.tapr.org/OHL)